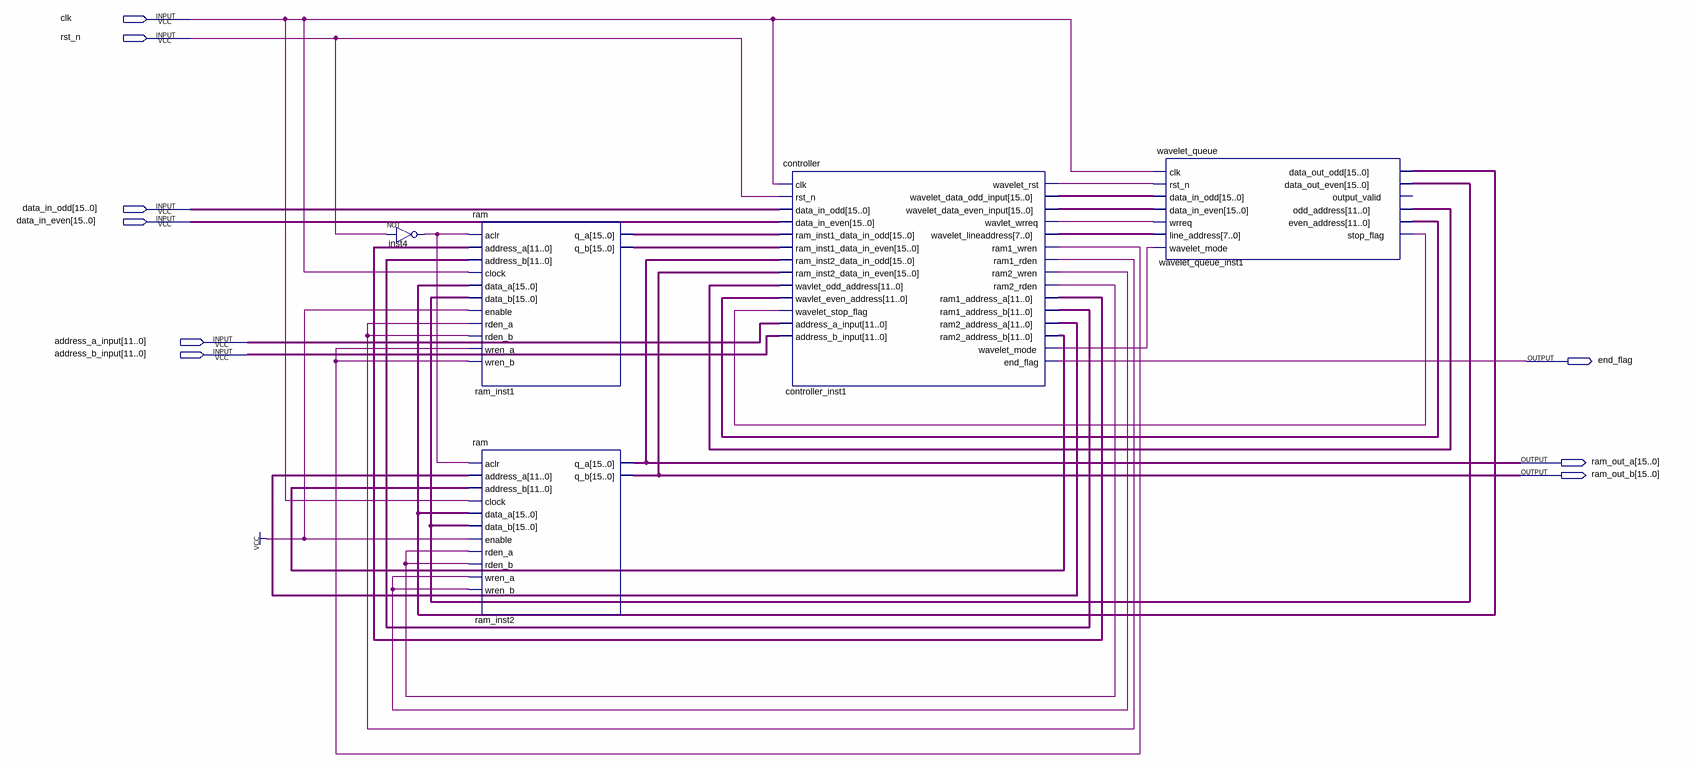
[diagram p0: schematic sheet]
// Quartus schematic wavelet_transform.bdf as structural Verilog: 5 symbols, 9 pins
module wavelet_transform (
  input  clk,
  input  rst_n,
  input  [15:0] data_in_odd,
  input  [15:0] data_in_even,
  input  [11:0] address_a_input,
  input  [11:0] address_b_input,
  output end_flag,
  output [15:0] ram_out_a,
  output [15:0] ram_out_b
);

  wire controller_inst1_ram1_rden, controller_inst1_ram1_wren, controller_inst1_ram2_rden,
       controller_inst1_ram2_wren, controller_inst1_wavelet_mode, controller_inst1_wavelet_rst,
       controller_inst1_wavlet_wrreq, inst4_out, wavelet_queue_inst1_stop_flag;
  wire [7:0] controller_inst1_wavelet_lineaddress;
  wire [11:0] controller_inst1_ram1_address_a, controller_inst1_ram1_address_b,
       controller_inst1_ram2_address_a, controller_inst1_ram2_address_b, wavelet_queue_inst1_even_address,
       wavelet_queue_inst1_odd_address;
  wire [15:0] controller_inst1_wavelet_data_even_input, controller_inst1_wavelet_data_odd_input,
       ram_inst1_q_a, ram_inst1_q_b, wavelet_queue_inst1_data_out_even, wavelet_queue_inst1_data_out_odd;

  not inst4 (inst4_out, rst_n);
  ram ram_inst1 (
    .aclr(inst4_out), .address_a(controller_inst1_ram1_address_a),
    .address_b(controller_inst1_ram1_address_b), .clock(clk), .data_a(wavelet_queue_inst1_data_out_odd),
    .data_b(wavelet_queue_inst1_data_out_even), .enable(1'b1), .rden_a(controller_inst1_ram1_rden),
    .rden_b(controller_inst1_ram1_rden), .wren_a(controller_inst1_ram1_wren),
    .wren_b(controller_inst1_ram1_wren), .q_a(ram_inst1_q_a), .q_b(ram_inst1_q_b));
  ram ram_inst2 (
    .aclr(inst4_out), .address_a(controller_inst1_ram2_address_a),
    .address_b(controller_inst1_ram2_address_b), .clock(clk), .data_a(wavelet_queue_inst1_data_out_odd),
    .data_b(wavelet_queue_inst1_data_out_even), .enable(1'b1), .rden_a(controller_inst1_ram2_rden),
    .rden_b(controller_inst1_ram2_rden), .wren_a(controller_inst1_ram2_wren),
    .wren_b(controller_inst1_ram2_wren), .q_a(ram_out_a), .q_b(ram_out_b));
  controller controller_inst1 (
    .clk(clk), .rst_n(rst_n), .data_in_odd(data_in_odd), .data_in_even(data_in_even),
    .ram_inst1_data_in_odd(ram_inst1_q_a), .ram_inst1_data_in_even(ram_inst1_q_b),
    .ram_inst2_data_in_odd(ram_out_a), .ram_inst2_data_in_even(ram_out_b),
    .wavlet_odd_address(wavelet_queue_inst1_odd_address),
    .wavlet_even_address(wavelet_queue_inst1_even_address),
    .wavelet_stop_flag(wavelet_queue_inst1_stop_flag), .address_a_input(address_a_input),
    .address_b_input(address_b_input), .wavelet_rst(controller_inst1_wavelet_rst),
    .wavelet_data_odd_input(controller_inst1_wavelet_data_odd_input),
    .wavelet_data_even_input(controller_inst1_wavelet_data_even_input),
    .wavlet_wrreq(controller_inst1_wavlet_wrreq), .wavelet_lineaddress(controller_inst1_wavelet_lineaddress),
    .ram1_wren(controller_inst1_ram1_wren), .ram1_rden(controller_inst1_ram1_rden),
    .ram2_wren(controller_inst1_ram2_wren), .ram2_rden(controller_inst1_ram2_rden),
    .ram1_address_a(controller_inst1_ram1_address_a), .ram1_address_b(controller_inst1_ram1_address_b),
    .ram2_address_a(controller_inst1_ram2_address_a), .ram2_address_b(controller_inst1_ram2_address_b),
    .wavelet_mode(controller_inst1_wavelet_mode), .end_flag(end_flag));
  wavelet_queue wavelet_queue_inst1 (
    .clk(clk), .rst_n(controller_inst1_wavelet_rst), .data_in_odd(controller_inst1_wavelet_data_odd_input),
    .data_in_even(controller_inst1_wavelet_data_even_input), .wrreq(controller_inst1_wavlet_wrreq),
    .line_address(controller_inst1_wavelet_lineaddress), .wavelet_mode(controller_inst1_wavelet_mode),
    .data_out_odd(wavelet_queue_inst1_data_out_odd), .data_out_even(wavelet_queue_inst1_data_out_even),
    .odd_address(wavelet_queue_inst1_odd_address), .even_address(wavelet_queue_inst1_even_address),
    .stop_flag(wavelet_queue_inst1_stop_flag));  // open: output_valid
endmodule
